# Altium schematic sheet First.SchDoc
size A4; SheetNumber: 1; SheetTotal: 1
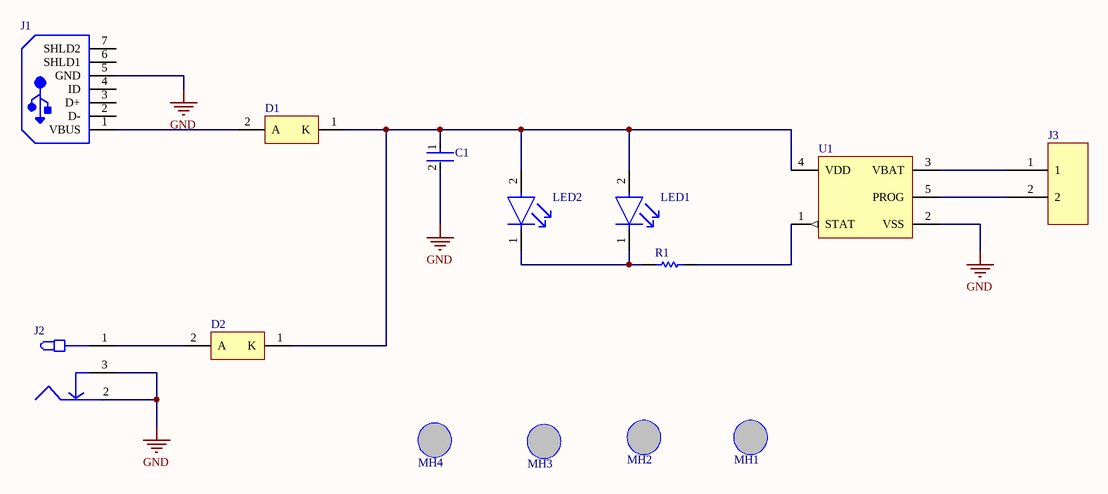
[diagram p0: First.SchDoc]

## Parts
C1  EMK325B7475MN-T  [FP-1210-L_3_2_0_3-W_2_5_0-IPC_B]  (value not drawn)
D1  MBRA140T3G  [ONSC-SMA-2-403D-02_V]  (value not drawn)
D2  MBRA140T3G  [ONSC-SMA-2-403D-02_V]  (value not drawn)
J1  USB3105-30-A  [GCT-USB3105-30-A_V]  (value not drawn)
J2  PJ-018H-SMT-TR  [FP-PJ-018H-SMT-TR-MFG]  (value not drawn)
J3  CONN HEADER R/A 2POS 5.08MM  [1-179276-2]  (value not drawn)
LED1  SML-LX0603SIW-TR  [FP-SML-LX0603SIW-TR-MFG]  (value not drawn)
LED2  SML-LX0603SIW-TR  [FP-SML-LX0603SIW-TR-MFG]  (value not drawn)
MH1  Mounting Hole Non Plated  [Mounting Hole]  (value not drawn)
MH2  Mounting Hole Non Plated  [Mounting Hole]  (value not drawn)
MH3  Mounting Hole Non Plated  [Mounting Hole]  (value not drawn)
MH4  Mounting Hole Non Plated  [Mounting Hole]  (value not drawn)
R1  TFCR0805-10W-E-2001BT  [FP-TFCR0805-IPC_C]  (value not drawn)
U1  ESP32-PICO-V3  [SOT-23-OT5_N]  (value not drawn)

## Nets
GND: C1.2 J1.5(GND) J2.2 J2.3 U1.2(VSS)
NetC1_1: C1.1 D1.1(K) D2.1(K) LED1.2(A) LED2.2(A) U1.4(VDD)
NetD1_2: D1.2(A) J1.1(VBUS)
NetD2_2: D2.2(A) J2.1
NetJ3_1: J3.1 U1.3(VBAT)
NetJ3_2: J3.2 U1.5(PROG)
NetLED1_1: LED1.1(C) LED2.1(C) R1.1
NetR1_2: R1.2 U1.1(STAT)

Not connected (* = marked no-connect by the designer): J1 2(D-) 3(D+) 4(ID) 6(SHLD1) 7(SHLD2)

## Library data of the parts
C1 = CMP-14477-000959-2: None; Voltage: 16V; Capacitance: 4.7uF; Dielectric Material: Ceramic; Dielectric: X7R; Tolerance: 20%; Width: 0.098inch; Thickness: 0.083inch; Height: 1.9mm; Mount: Surface Mount; Length: 3.2mm; Radiation Hardening: No; Case Code (Metric): 3225; Depth: 2.5mm; Series: M; Construction: Flat; Resistor Type: Ceramic; Weight: 0.000564oz; RoHS Compliant: Yes; Package Quantity: 2000; Min Operating Temperature: -55°C; Termination: SMD/SMT; Voltage Rating (DC): 16V; Voltage Rating: 16V; Packaging: Tape and Reel; Number of Pins: 2; Case Code (Imperial): 1210; Case/Package: 1210; Max Operating Temperature: 125°C; Lead Free: Lead Free; Halogen Free: Halogen Free
D1 D2 = CMP-1055-00320-1: Schottky Power Rectifier, 2-Pin SMA, Pb-Free, Tape and Reel; Manufacturer: On Semiconductor; Configuration: Single; IFSM Max (A): 30; PackageReference: SMA-2-403D-02; PackageDescription: 2-Pin Small Molded Package, J-Bend Lead, Body 2.605 x 4.315 mm; RoHS: TRUE; ComponentLink1Description: Manufacturer URL; Packing: Tape and Reel; ComponentLink3URL: http://www.onsemi.com/pub_link/Collateral/403D-02.PDF; ComponentLink2Description: Datasheet; ComponentLink2URL: http://www.onsemi.cn/pub_link/Collateral/MBRA140T3-D.PDF; DatasheetVersion: Rev. 10; ComponentLink1URL: http://www.onsemi.com/; PartNumber: MBRA140T3G; ComponentLink3Description: Package Specification; Mounting Technology: Surface Mount; PackageVersion: Rev. G, 07/2012
J1 = CMP-2000-07366-1: USB 2.0 A/B Receptacle, 30 V, -55 to 85 degC, 5-Pin THD, RoHS, Tape and Reel; Manufacturer: Global Connector Technology; USB Standard: USB2.0; Connector Mounting: ThroughHoleMount; USB Connector Type: MicroUSBTypeAB; No. of Positions: 5Ways; Product Range: -; Package Description: 5-Pin Through Hole Device, Body 7.96 x 2.9 mm, Pitch 0.65 mm; Package Reference: USB3105-30-A; Gender: Receptacle; Datasheet URL: http://gct.co/usb-connectors/pdf/USB3105.pdf; Mounting Technology: ThroughHole; Orientation: Vertical; Contact Material: CopperAlloy; Contact Plating: GoldPlatedContacts; Manufacturer URL: http://gct.co/; Datasheet Version: Rev. F, 05/2015
J2 = CMP-14830-000007-1: CONN PWR JACK 1.7X4MM SOLDER; Manufacturer: CUI; Current Rating: 5A; Conn Orientation: Right Angle; Standoff Height: 0.1mm; Conn Gender: Male; Number Of Contacts: 1; Voltage Rating: 24V; Device Class L3: unset; Digikey Description: CONN PWR JACK 1.7X4MM SOLDER; Mouser Description: DC Power Connectors Power Jacks; Category: Conn; Temperature: -25°C to +85°C; Temperature Range High: +85°C; Device Class L2: Power Connectors; Package: 0; Octopart: https://octopart.com/pj-018h-smt-tr-cui-25947163; Automotive: No; Manufacturer Part Number: PJ-018H-SMT-TR; Device Class L1: Connectors; Height: 5.6mm; RoHS: TRUE; Temperature Range Low: -25°C; Contact Material: Nickel,Silver; Lead Free: Yes; ComponentLink2Description: Datasheet; ComponentLink2URL: https://www.cuidevices.com/product/resource/pj-018h-smt-tr.pdf
J3 = 1-179276-2: Connector Header Through Hole, Right Angle 2 position 0.200" (5.08mm); Manufacturer: TE Connectivity AMP Connectors; Manufecturer Part Number: 1-179276-2
LED1 LED2 = CMP-57192-000009-1: LED RED DIFFUSED SMD; Test Current: 20mA; Forward Voltage: 2V; Approvals: UL; Dominant Wavelength: 636nm; Viewing Angle: 140°; Lens Color: White; Luminous Intensity: 60mcd; Power Rating: 50mW; Number of LEDs: 1; Color: Red; Forward Current: 20mA; Moisture Sensitivity Level: 2; Case Code (Imperial): 0603; Lead Free: Lead Free; Lens Transparency: Diffused; Case Code (Metric): 1608; Height: 0.6mm; Max Operating Temperature: 85°C; Width: 0.8mm; Lens Style: Diffused; Illumination Color: Red; Wavelength: 636nm; REACH SVHC: No SVHC; Package Quantity: 1; RoHS Compliant: Yes; Case/Package: 0603; Number of Pins: 2; Packaging: Tape and Reel; Length: 1.6mm; Mount: Surface Mount; Min Operating Temperature: -25°C
MH1-MH4 = Mounting Hole
R1 = CMP-2002-07985-1: Part Number: RC0402JR-07330RL; Manufacturer: Yageo / Phycomp
U1 = CMP-0133-00136-1: Miniature Single-Cell, Fully Integrated Li-Ion, Li-Polymer Charge Management Controller, 4.5V, 5-Pin SOT-23, Industrial Temperature, Tape and Reel; PackageReference: SOT-23-OT5; PackageDescription: 5-Lead Plastic Small Outline Transistor (OT) [SOT-23]; PackageVersion: revBB, Aug-2009; DatasheetVersion: revE, Sep-2008; Code_IPC: SOT23-5